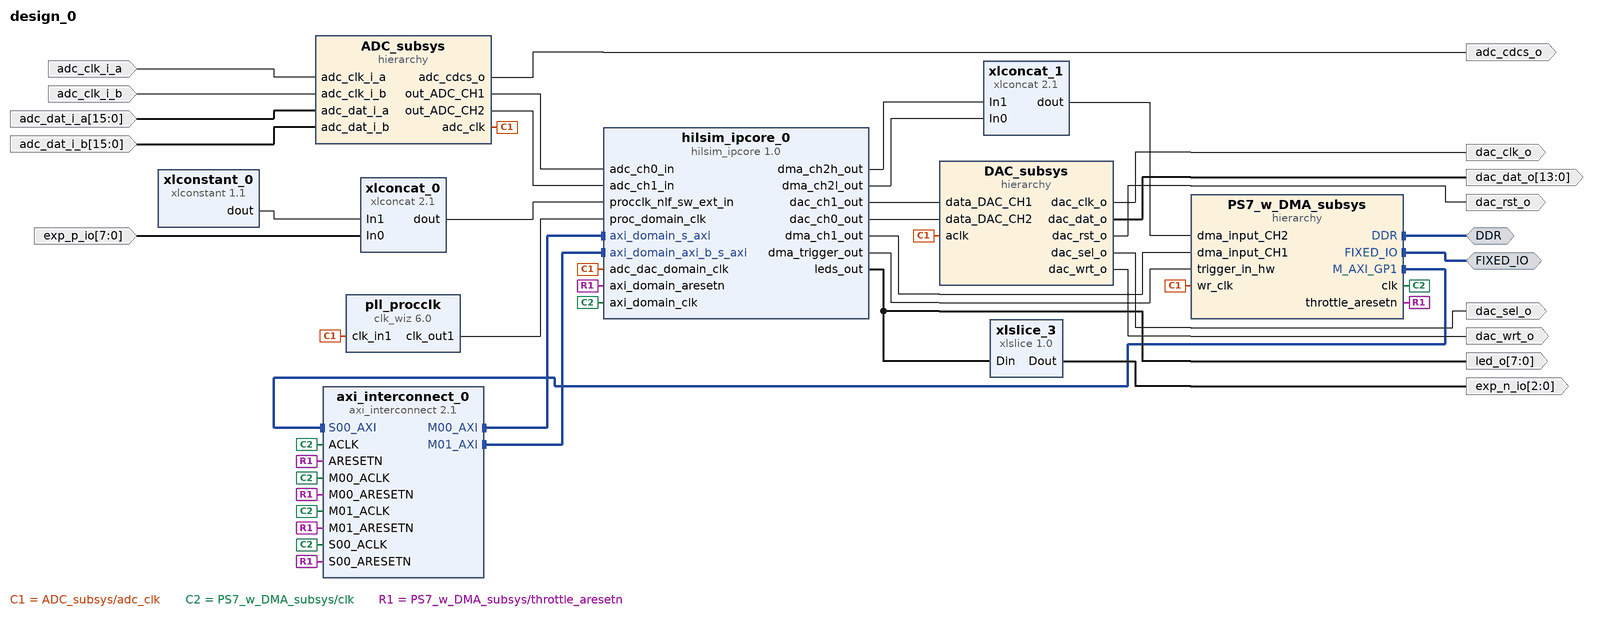
[diagram p0: block diagram of the top level]
# Vivado block design design_0, xc7z020clg400-1, Vivado 2024.2
create_bd_design design_0

create_bd_intf_port -mode Master -vlnv xilinx.com:interface:ddrx_rtl:1.0 DDR
create_bd_intf_port -mode Master -vlnv xilinx.com:display_processing_system7:fixedio_rtl:1.0 FIXED_IO
create_bd_port -dir O adc_cdcs_o
create_bd_port -dir I -type clk adc_clk_i_a
set_property -dict {CONFIG.FREQ_HZ 125000000} [get_bd_ports adc_clk_i_a]
create_bd_port -dir I -type clk adc_clk_i_b
set_property -dict {CONFIG.FREQ_HZ 125000000} [get_bd_ports adc_clk_i_b]
create_bd_port -dir I -from 15 -to 0 adc_dat_i_a
create_bd_port -dir I -from 15 -to 0 adc_dat_i_b
create_bd_port -dir O -type clk dac_clk_o
create_bd_port -dir O -from 13 -to 0 dac_dat_o
create_bd_port -dir O dac_rst_o
create_bd_port -dir O dac_sel_o
create_bd_port -dir O dac_wrt_o
create_bd_port -dir O -from 2 -to 0 exp_n_io
create_bd_port -dir I -from 7 -to 0 exp_p_io
create_bd_port -dir O -from 7 -to 0 led_o

create_bd_cell -type hier ADC_subsys
create_bd_cell -type hier DAC_subsys
create_bd_cell -type hier PS7_w_DMA_subsys
create_bd_cell -type ip -vlnv xilinx.com:ip:xlconcat:2.1 xlconcat_1
set_property -dict {CONFIG.dout_width 32} [get_bd_cells xlconcat_1]
create_bd_cell -type ip -vlnv xilinx.com:ip:xlslice:1.0 xlslice_3
set_property -dict {CONFIG.DIN_FROM 2 CONFIG.DIN_WIDTH 8 CONFIG.DOUT_WIDTH 3} [get_bd_cells xlslice_3]
create_bd_cell -type ip -vlnv xilinx.com:ip:clk_wiz:6.0 pll_procclk
set_property -dict [list \
  CONFIG.CLKIN1_JITTER_PS 80.0 \
  CONFIG.CLKOUT1_DRIVES BUFG \
  CONFIG.CLKOUT1_JITTER 104.759 \
  CONFIG.CLKOUT1_PHASE_ERROR 96.948 \
  CONFIG.CLKOUT1_REQUESTED_OUT_FREQ 250 \
  CONFIG.CLKOUT2_DRIVES BUFG \
  CONFIG.CLKOUT3_DRIVES BUFG \
  CONFIG.CLKOUT4_DRIVES BUFG \
  CONFIG.CLKOUT5_DRIVES BUFG \
  CONFIG.CLKOUT6_DRIVES BUFG \
  CONFIG.CLKOUT7_DRIVES BUFG \
  CONFIG.FEEDBACK_SOURCE FDBK_AUTO \
  CONFIG.MMCM_BANDWIDTH OPTIMIZED \
  CONFIG.MMCM_CLKFBOUT_MULT_F 8.000 \
  CONFIG.MMCM_CLKIN1_PERIOD 8.000 \
  CONFIG.MMCM_CLKIN2_PERIOD 10.000 \
  CONFIG.MMCM_CLKOUT0_DIVIDE_F 4.000 \
  CONFIG.MMCM_COMPENSATION ZHOLD \
  CONFIG.MMCM_DIVCLK_DIVIDE 1 \
  CONFIG.OVERRIDE_MMCM false \
  CONFIG.PLL_CLKIN_PERIOD 8.000 \
  CONFIG.PRIMITIVE MMCM \
  CONFIG.PRIM_IN_FREQ 125 \
  CONFIG.PRIM_SOURCE Global_buffer \
  CONFIG.USE_LOCKED false \
  CONFIG.USE_RESET false \
] [get_bd_cells pll_procclk]
create_bd_cell -type ip -vlnv User_Company:VMC:hilsim_ipcore:1.0 hilsim_ipcore_0
create_bd_cell -type ip -vlnv xilinx.com:ip:axi_interconnect:2.1 axi_interconnect_0
set_property -dict [list \
  CONFIG.M00_HAS_REGSLICE 1 \
  CONFIG.M01_HAS_REGSLICE 1 \
  CONFIG.NUM_MI 2 \
  CONFIG.NUM_SI 1 \
  CONFIG.S00_HAS_DATA_FIFO 2 \
  CONFIG.S00_HAS_REGSLICE 1 \
  CONFIG.STRATEGY 1 \
] [get_bd_cells axi_interconnect_0]
create_bd_cell -type ip -vlnv xilinx.com:ip:xlconstant:1.1 xlconstant_0
set_property -dict {CONFIG.CONST_VAL 0 CONFIG.CONST_WIDTH 1} [get_bd_cells xlconstant_0]
create_bd_cell -type ip -vlnv xilinx.com:ip:xlconcat:2.1 xlconcat_0
set_property -dict {CONFIG.IN0_WIDTH 8 CONFIG.IN1_WIDTH 1 CONFIG.dout_width 9} [get_bd_cells xlconcat_0]

# ---- hierarchy /ADC_subsys ----
current_bd_instance /ADC_subsys
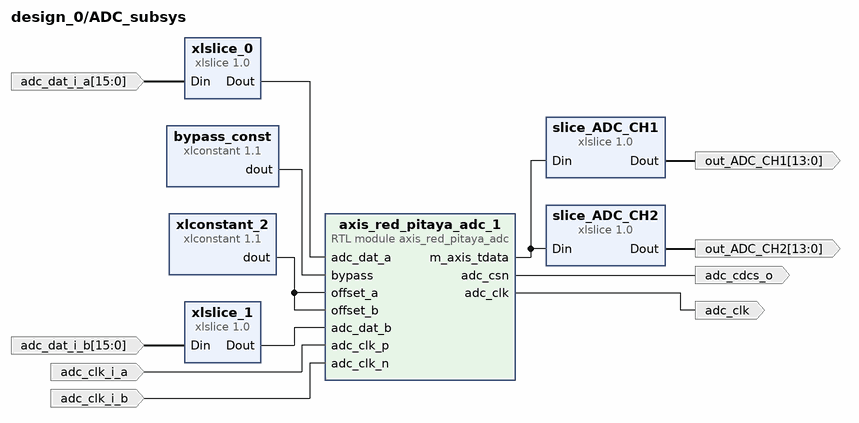
[diagram p1: block diagram inside /ADC_subsys]
create_bd_pin -dir I -from 15 -to 0 adc_dat_i_a
create_bd_pin -dir I -from 15 -to 0 adc_dat_i_b
create_bd_pin -dir O -type clk adc_clk
create_bd_pin -dir O adc_cdcs_o
create_bd_pin -dir I -type clk adc_clk_i_a
create_bd_pin -dir I -type clk adc_clk_i_b
create_bd_pin -dir O -from 13 -to 0 out_ADC_CH1
create_bd_pin -dir O -from 13 -to 0 out_ADC_CH2

create_bd_cell -type ip -vlnv xilinx.com:ip:xlslice:1.0 xlslice_0
set_property -dict {CONFIG.DIN_FROM 15 CONFIG.DIN_TO 2 CONFIG.DIN_WIDTH 16 CONFIG.DOUT_WIDTH 14} [get_bd_cells xlslice_0]
create_bd_cell -type ip -vlnv xilinx.com:ip:xlslice:1.0 xlslice_1
set_property -dict {CONFIG.DIN_FROM 15 CONFIG.DIN_TO 2 CONFIG.DIN_WIDTH 16 CONFIG.DOUT_WIDTH 14} [get_bd_cells xlslice_1]
create_bd_cell -type ip -vlnv xilinx.com:ip:xlconstant:1.1 xlconstant_2
set_property -dict {CONFIG.CONST_VAL 0 CONFIG.CONST_WIDTH 14} [get_bd_cells xlconstant_2]
create_bd_cell -type ip -vlnv xilinx.com:ip:xlconstant:1.1 bypass_const
set_property -dict {CONFIG.CONST_VAL 0} [get_bd_cells bypass_const]
create_bd_cell -type ip -vlnv xilinx.com:ip:xlslice:1.0 slice_ADC_CH1
set_property -dict {CONFIG.DIN_FROM 13 CONFIG.DIN_TO 0 CONFIG.DIN_WIDTH 32 CONFIG.DOUT_WIDTH 14} [get_bd_cells slice_ADC_CH1]
create_bd_cell -type ip -vlnv xilinx.com:ip:xlslice:1.0 slice_ADC_CH2
set_property -dict {CONFIG.DIN_FROM 29 CONFIG.DIN_TO 16 CONFIG.DIN_WIDTH 32 CONFIG.DOUT_WIDTH 14} [get_bd_cells slice_ADC_CH2]
create_bd_cell -type module -reference axis_red_pitaya_adc axis_red_pitaya_adc_1

# ---- hierarchy /DAC_subsys ----
current_bd_instance /DAC_subsys
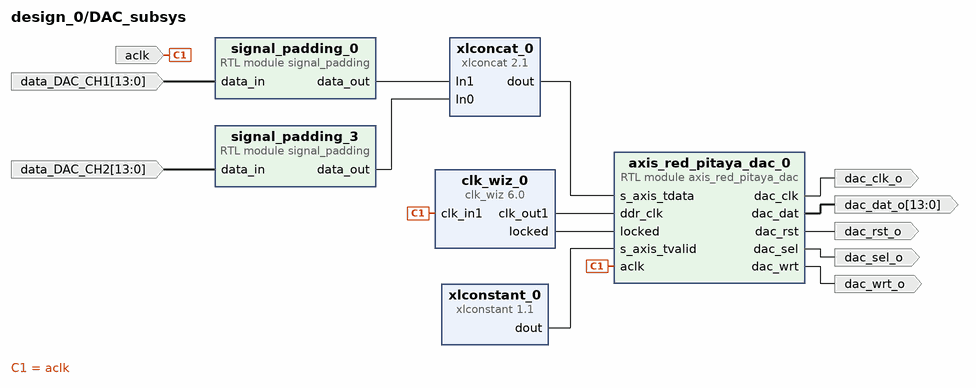
[diagram p2: block diagram inside /DAC_subsys]
create_bd_pin -dir I -from 13 -to 0 data_DAC_CH1
create_bd_pin -dir I -from 13 -to 0 data_DAC_CH2
create_bd_pin -dir I -type clk aclk
create_bd_pin -dir O -type clk dac_clk_o
create_bd_pin -dir O -type rst dac_rst_o
create_bd_pin -dir O dac_sel_o
create_bd_pin -dir O dac_wrt_o
create_bd_pin -dir O -from 13 -to 0 dac_dat_o

create_bd_cell -type ip -vlnv xilinx.com:ip:xlconcat:2.1 xlconcat_0
set_property -dict {CONFIG.dout_width 32} [get_bd_cells xlconcat_0]
create_bd_cell -type ip -vlnv xilinx.com:ip:xlconstant:1.1 xlconstant_0
create_bd_cell -type module -reference signal_padding signal_padding_0
set_property -dict {CONFIG.DATA_WIDTH_IN 14 CONFIG.DATA_WIDTH_OUT 16} [get_bd_cells signal_padding_0]
create_bd_cell -type module -reference signal_padding signal_padding_3
set_property -dict {CONFIG.DATA_WIDTH_IN 14 CONFIG.DATA_WIDTH_OUT 16} [get_bd_cells signal_padding_3]
create_bd_cell -type ip -vlnv xilinx.com:ip:clk_wiz:6.0 clk_wiz_0
set_property -dict [list \
  CONFIG.CLKIN1_JITTER_PS 80.0 \
  CONFIG.CLKOUT1_JITTER 104.759 \
  CONFIG.CLKOUT1_PHASE_ERROR 96.948 \
  CONFIG.CLKOUT1_REQUESTED_OUT_FREQ 250 \
  CONFIG.MMCM_CLKFBOUT_MULT_F 8.000 \
  CONFIG.MMCM_CLKIN1_PERIOD 8.000 \
  CONFIG.MMCM_CLKOUT0_DIVIDE_F 4.000 \
  CONFIG.PRIM_SOURCE Global_buffer \
  CONFIG.USE_RESET false \
] [get_bd_cells clk_wiz_0]
create_bd_cell -type module -reference axis_red_pitaya_dac axis_red_pitaya_dac_0

# ---- hierarchy /PS7_w_DMA_subsys ----
current_bd_instance /PS7_w_DMA_subsys
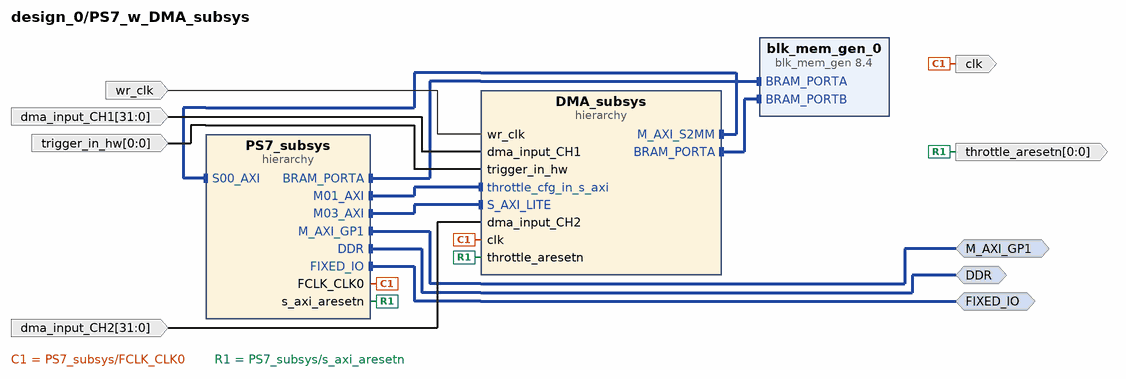
[diagram p3: block diagram inside /PS7_w_DMA_subsys]
create_bd_intf_pin -mode Master -vlnv xilinx.com:interface:ddrx_rtl:1.0 DDR
create_bd_intf_pin -mode Master -vlnv xilinx.com:display_processing_system7:fixedio_rtl:1.0 FIXED_IO
create_bd_intf_pin -mode Master -vlnv xilinx.com:interface:aximm_rtl:1.0 M_AXI_GP1
create_bd_pin -dir O -type clk clk
create_bd_pin -dir O -from 0 -to 0 -type rst throttle_aresetn
create_bd_pin -dir I -type clk wr_clk
create_bd_pin -dir I -from 31 -to 0 dma_input_CH1
create_bd_pin -dir I -from 31 -to 0 dma_input_CH2
create_bd_pin -dir I -from 0 -to 0 -type data trigger_in_hw

create_bd_cell -type ip -vlnv xilinx.com:ip:blk_mem_gen:8.4 blk_mem_gen_0
set_property -dict [list \
  CONFIG.Assume_Synchronous_Clk false \
  CONFIG.EN_SAFETY_CKT false \
  CONFIG.Enable_32bit_Address true \
  CONFIG.Enable_B Use_ENB_Pin \
  CONFIG.Memory_Type True_Dual_Port_RAM \
  CONFIG.Port_B_Clock 100 \
  CONFIG.Port_B_Enable_Rate 100 \
  CONFIG.Port_B_Write_Rate 50 \
  CONFIG.Register_PortA_Output_of_Memory_Primitives false \
  CONFIG.Register_PortB_Output_of_Memory_Primitives false \
  CONFIG.Use_RSTA_Pin true \
  CONFIG.Use_RSTB_Pin true \
  CONFIG.use_bram_block BRAM_Controller \
] [get_bd_cells blk_mem_gen_0]
create_bd_cell -type hier PS7_subsys
create_bd_cell -type hier DMA_subsys

# ---- hierarchy /PS7_w_DMA_subsys/PS7_subsys ----
current_bd_instance /PS7_w_DMA_subsys/PS7_subsys
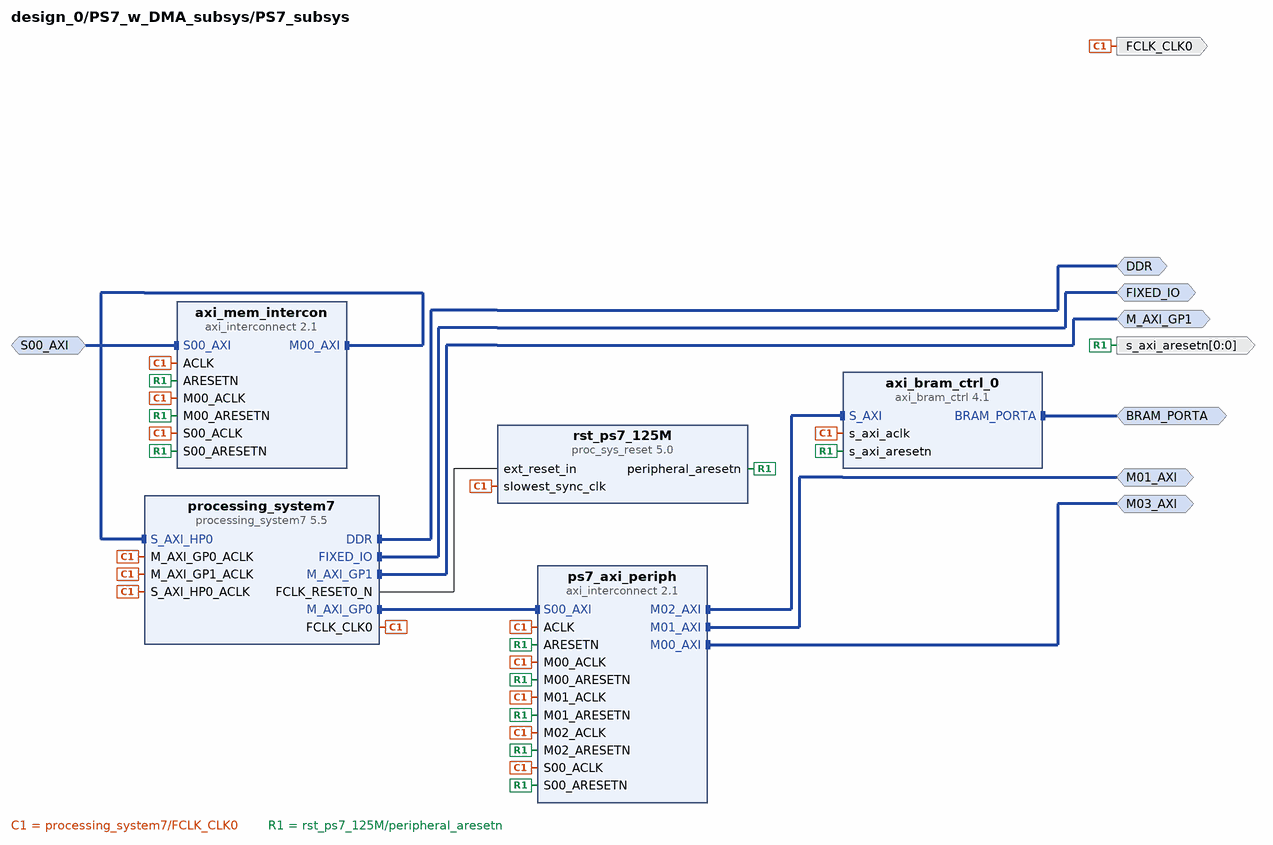
[diagram p4: block diagram inside /PS7_w_DMA_subsys/PS7_subsys]
create_bd_intf_pin -mode Master -vlnv xilinx.com:interface:ddrx_rtl:1.0 DDR
create_bd_intf_pin -mode Master -vlnv xilinx.com:display_processing_system7:fixedio_rtl:1.0 FIXED_IO
create_bd_intf_pin -mode Master -vlnv xilinx.com:interface:bram_rtl:1.0 BRAM_PORTA
create_bd_intf_pin -mode Slave -vlnv xilinx.com:interface:aximm_rtl:1.0 S00_AXI
create_bd_intf_pin -mode Master -vlnv xilinx.com:interface:aximm_rtl:1.0 M01_AXI
create_bd_intf_pin -mode Master -vlnv xilinx.com:interface:aximm_rtl:1.0 M03_AXI
create_bd_intf_pin -mode Master -vlnv xilinx.com:interface:aximm_rtl:1.0 M_AXI_GP1
create_bd_pin -dir O -type clk FCLK_CLK0
create_bd_pin -dir O -from 0 -to 0 -type rst s_axi_aresetn

create_bd_cell -type ip -vlnv xilinx.com:ip:processing_system7:5.5 processing_system7
set_property -dict [list \
  CONFIG.PCW_APU_PERIPHERAL_FREQMHZ 666.666666 \
  CONFIG.PCW_ENET0_ENET0_IO {MIO 16 .. 27} \
  CONFIG.PCW_ENET0_GRP_MDIO_ENABLE 1 \
  CONFIG.PCW_ENET0_GRP_MDIO_IO {MIO 52 .. 53} \
  CONFIG.PCW_ENET0_PERIPHERAL_ENABLE 1 \
  CONFIG.PCW_EN_RST1_PORT 1 \
  CONFIG.PCW_EN_RST2_PORT 1 \
  CONFIG.PCW_EN_RST3_PORT 1 \
  CONFIG.PCW_FPGA0_PERIPHERAL_FREQMHZ 125 \
  CONFIG.PCW_FPGA1_PERIPHERAL_FREQMHZ 250 \
  CONFIG.PCW_FPGA3_PERIPHERAL_FREQMHZ 200 \
  CONFIG.PCW_FTM_CTI_IN0 DISABLED \
  CONFIG.PCW_FTM_CTI_IN1 DISABLED \
  CONFIG.PCW_FTM_CTI_IN2 DISABLED \
  CONFIG.PCW_FTM_CTI_IN3 DISABLED \
  CONFIG.PCW_FTM_CTI_OUT0 DISABLED \
  CONFIG.PCW_FTM_CTI_OUT1 DISABLED \
  CONFIG.PCW_FTM_CTI_OUT2 DISABLED \
  CONFIG.PCW_FTM_CTI_OUT3 DISABLED \
  CONFIG.PCW_GPIO_MIO_GPIO_ENABLE 0 \
  CONFIG.PCW_I2C0_GRP_INT_ENABLE 0 \
  CONFIG.PCW_I2C0_I2C0_IO {MIO 50 .. 51} \
  CONFIG.PCW_I2C0_PERIPHERAL_ENABLE 1 \
  CONFIG.PCW_I2C_PERIPHERAL_FREQMHZ 111.111115 \
  CONFIG.PCW_PERIPHERAL_BOARD_PRESET None \
  CONFIG.PCW_PRESET_BANK1_VOLTAGE {LVCMOS 2.5V} \
  CONFIG.PCW_QSPI_GRP_SINGLE_SS_ENABLE 1 \
  CONFIG.PCW_QSPI_GRP_SINGLE_SS_IO {MIO 1 .. 6} \
  CONFIG.PCW_QSPI_PERIPHERAL_ENABLE 1 \
  CONFIG.PCW_QSPI_PERIPHERAL_FREQMHZ 125 \
  CONFIG.PCW_QSPI_QSPI_IO {MIO 1 .. 6} \
  CONFIG.PCW_SD0_GRP_CD_ENABLE 1 \
  CONFIG.PCW_SD0_GRP_CD_IO {MIO 46} \
  CONFIG.PCW_SD0_GRP_WP_ENABLE 1 \
  CONFIG.PCW_SD0_GRP_WP_IO {MIO 47} \
  CONFIG.PCW_SD0_PERIPHERAL_ENABLE 1 \
  CONFIG.PCW_SD0_SD0_IO {MIO 40 .. 45} \
  CONFIG.PCW_SDIO_PERIPHERAL_FREQMHZ 100 \
  CONFIG.PCW_SINGLE_QSPI_DATA_MODE x4 \
  CONFIG.PCW_SPI0_PERIPHERAL_ENABLE 1 \
  CONFIG.PCW_SPI0_SPI0_IO EMIO \
  CONFIG.PCW_SPI1_PERIPHERAL_ENABLE 1 \
  CONFIG.PCW_SPI1_SPI1_IO {MIO 10 .. 15} \
  CONFIG.PCW_SPI_PERIPHERAL_FREQMHZ 200 \
  CONFIG.PCW_TTC0_PERIPHERAL_ENABLE 1 \
  CONFIG.PCW_TTC0_TTC0_IO EMIO \
  CONFIG.PCW_UART0_PERIPHERAL_ENABLE 1 \
  CONFIG.PCW_UART0_UART0_IO {MIO 14 .. 15} \
  CONFIG.PCW_UART1_PERIPHERAL_ENABLE 1 \
  CONFIG.PCW_UART1_UART1_IO {MIO 8 .. 9} \
  CONFIG.PCW_UART_PERIPHERAL_FREQMHZ 100 \
  CONFIG.PCW_UIPARAM_DDR_BUS_WIDTH {16 Bit} \
  CONFIG.PCW_UIPARAM_DDR_FREQ_MHZ 533.333333 \
  CONFIG.PCW_UIPARAM_DDR_PARTNO {MT41J256M16 RE-125} \
  CONFIG.PCW_USB0_PERIPHERAL_ENABLE 0 \
  CONFIG.PCW_USE_CROSS_TRIGGER 1 \
  CONFIG.PCW_USE_FABRIC_INTERRUPT 1 \
  CONFIG.PCW_USE_M_AXI_GP1 1 \
  CONFIG.PCW_USE_S_AXI_HP0 1 \
] [get_bd_cells processing_system7]
# 474 more settings of processing_system7 are not shown: defaults, MIO pin electricals, DDR timing, and values the tool derives
create_bd_cell -type ip -vlnv xilinx.com:ip:proc_sys_reset:5.0 rst_ps7_125M
create_bd_cell -type ip -vlnv xilinx.com:ip:axi_bram_ctrl:4.1 axi_bram_ctrl_0
set_property -dict {CONFIG.PROTOCOL AXI4 CONFIG.SINGLE_PORT_BRAM 1} [get_bd_cells axi_bram_ctrl_0]
create_bd_cell -type ip -vlnv xilinx.com:ip:axi_interconnect:2.1 axi_mem_intercon
set_property -dict {CONFIG.NUM_MI 1} [get_bd_cells axi_mem_intercon]
create_bd_cell -type ip -vlnv xilinx.com:ip:axi_interconnect:2.1 ps7_axi_periph
set_property -dict {CONFIG.NUM_MI 3 CONFIG.S00_HAS_DATA_FIFO 2 CONFIG.STRATEGY 2} [get_bd_cells ps7_axi_periph]

# ---- hierarchy /PS7_w_DMA_subsys/DMA_subsys ----
current_bd_instance /PS7_w_DMA_subsys/DMA_subsys
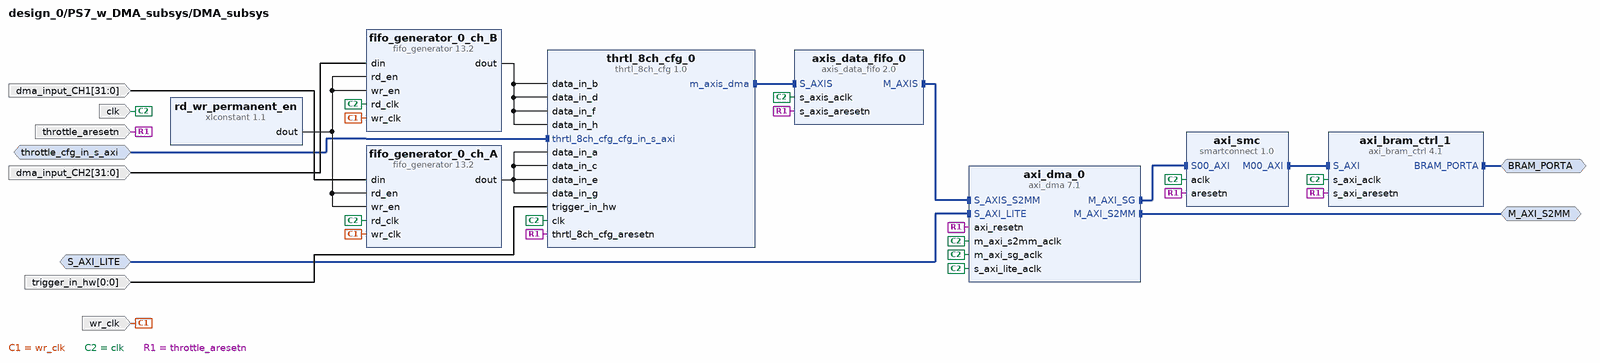
[diagram p5: block diagram inside /PS7_w_DMA_subsys/DMA_subsys]
create_bd_intf_pin -mode Slave -vlnv xilinx.com:interface:aximm_rtl:1.0 throttle_cfg_in_s_axi
create_bd_intf_pin -mode Slave -vlnv xilinx.com:interface:aximm_rtl:1.0 S_AXI_LITE
create_bd_intf_pin -mode Master -vlnv xilinx.com:interface:aximm_rtl:1.0 M_AXI_S2MM
create_bd_intf_pin -mode Master -vlnv xilinx.com:interface:bram_rtl:1.0 BRAM_PORTA
create_bd_pin -dir I -type clk wr_clk
create_bd_pin -dir I -type clk clk
create_bd_pin -dir I -from 31 -to 0 dma_input_CH1
create_bd_pin -dir I -type rst throttle_aresetn
create_bd_pin -dir I -from 31 -to 0 dma_input_CH2
create_bd_pin -dir I -from 0 -to 0 -type data trigger_in_hw

create_bd_cell -type ip -vlnv xilinx.com:ip:fifo_generator:13.2 fifo_generator_0_ch_A
set_property -dict [list \
  CONFIG.Fifo_Implementation Independent_Clocks_Distributed_RAM \
  CONFIG.Input_Data_Width 32 \
  CONFIG.Input_Depth 16 \
  CONFIG.Performance_Options First_Word_Fall_Through \
  CONFIG.Reset_Pin false \
] [get_bd_cells fifo_generator_0_ch_A]
create_bd_cell -type ip -vlnv xilinx.com:ip:smartconnect:1.0 axi_smc
set_property -dict {CONFIG.NUM_SI 1} [get_bd_cells axi_smc]
create_bd_cell -type ip -vlnv xilinx.com:ip:fifo_generator:13.2 fifo_generator_0_ch_B
set_property -dict [list \
  CONFIG.Fifo_Implementation Independent_Clocks_Distributed_RAM \
  CONFIG.Input_Data_Width 32 \
  CONFIG.Input_Depth 16 \
  CONFIG.Performance_Options First_Word_Fall_Through \
  CONFIG.Reset_Pin false \
] [get_bd_cells fifo_generator_0_ch_B]
create_bd_cell -type ip -vlnv xilinx.com:ip:axi_dma:7.1 axi_dma_0
set_property -dict [list \
  CONFIG.c_include_mm2s 0 \
  CONFIG.c_include_s2mm_dre 1 \
  CONFIG.c_s2mm_burst_size 256 \
  CONFIG.c_sg_include_stscntrl_strm 0 \
  CONFIG.c_sg_length_width 26 \
] [get_bd_cells axi_dma_0]
create_bd_cell -type ip -vlnv xilinx.com:ip:xlconstant:1.1 rd_wr_permanent_en
set_property -dict {CONFIG.CONST_VAL 1} [get_bd_cells rd_wr_permanent_en]
create_bd_cell -type ip -vlnv xilinx.com:ip:axi_bram_ctrl:4.1 axi_bram_ctrl_1
set_property -dict {CONFIG.PROTOCOL AXI4 CONFIG.RD_CMD_OPTIMIZATION 1 CONFIG.SINGLE_PORT_BRAM 1} [get_bd_cells axi_bram_ctrl_1]
create_bd_cell -type ip -vlnv VM:SysGen:thrtl_8ch_cfg:1.0 thrtl_8ch_cfg_0
create_bd_cell -type ip -vlnv xilinx.com:ip:axis_data_fifo:2.0 axis_data_fifo_0

# ---- connections ----

current_bd_instance /ADC_subsys
connect_bd_net [get_bd_pins adc_clk_i_a] [get_bd_pins axis_red_pitaya_adc_1/adc_clk_p]
connect_bd_net [get_bd_pins adc_clk_i_b] [get_bd_pins axis_red_pitaya_adc_1/adc_clk_n]
connect_bd_net [get_bd_pins adc_dat_i_a] [get_bd_pins xlslice_0/Din]
connect_bd_net [get_bd_pins adc_dat_i_b] [get_bd_pins xlslice_1/Din]
connect_bd_net [get_bd_pins axis_red_pitaya_adc_1/adc_clk] [get_bd_pins adc_clk]
connect_bd_net [get_bd_pins axis_red_pitaya_adc_1/adc_csn] [get_bd_pins adc_cdcs_o]
connect_bd_net [get_bd_pins axis_red_pitaya_adc_1/m_axis_tdata] [get_bd_pins slice_ADC_CH1/Din] [get_bd_pins slice_ADC_CH2/Din]
connect_bd_net [get_bd_pins bypass_const/dout] [get_bd_pins axis_red_pitaya_adc_1/bypass]
connect_bd_net [get_bd_pins xlconstant_2/dout] [get_bd_pins axis_red_pitaya_adc_1/offset_a] [get_bd_pins axis_red_pitaya_adc_1/offset_b]
connect_bd_net [get_bd_pins xlslice_0/Dout] [get_bd_pins axis_red_pitaya_adc_1/adc_dat_a]
connect_bd_net [get_bd_pins xlslice_1/Dout] [get_bd_pins axis_red_pitaya_adc_1/adc_dat_b]
connect_bd_net -net xlslice_2_Dout [get_bd_pins slice_ADC_CH2/Dout] [get_bd_pins out_ADC_CH2]
connect_bd_net -net xlslice_4_Dout [get_bd_pins slice_ADC_CH1/Dout] [get_bd_pins out_ADC_CH1]

current_bd_instance /DAC_subsys
connect_bd_net [get_bd_pins aclk] [get_bd_pins axis_red_pitaya_dac_0/aclk] [get_bd_pins clk_wiz_0/clk_in1]
connect_bd_net [get_bd_pins axis_red_pitaya_dac_0/dac_clk] [get_bd_pins dac_clk_o]
connect_bd_net [get_bd_pins axis_red_pitaya_dac_0/dac_dat] [get_bd_pins dac_dat_o]
connect_bd_net [get_bd_pins axis_red_pitaya_dac_0/dac_rst] [get_bd_pins dac_rst_o]
connect_bd_net [get_bd_pins axis_red_pitaya_dac_0/dac_sel] [get_bd_pins dac_sel_o]
connect_bd_net [get_bd_pins axis_red_pitaya_dac_0/dac_wrt] [get_bd_pins dac_wrt_o]
connect_bd_net [get_bd_pins clk_wiz_0/clk_out1] [get_bd_pins axis_red_pitaya_dac_0/ddr_clk]
connect_bd_net [get_bd_pins clk_wiz_0/locked] [get_bd_pins axis_red_pitaya_dac_0/locked]
connect_bd_net -net fpga_kf1_0_dac_pulse_out [get_bd_pins data_DAC_CH2] [get_bd_pins signal_padding_3/data_in]
connect_bd_net -net fpga_kf1_0_gate_fb_out [get_bd_pins data_DAC_CH1] [get_bd_pins signal_padding_0/data_in]
connect_bd_net [get_bd_pins signal_padding_0/data_out] [get_bd_pins xlconcat_0/In1]
connect_bd_net [get_bd_pins signal_padding_3/data_out] [get_bd_pins xlconcat_0/In0]
connect_bd_net [get_bd_pins xlconcat_0/dout] [get_bd_pins axis_red_pitaya_dac_0/s_axis_tdata]
connect_bd_net [get_bd_pins xlconstant_0/dout] [get_bd_pins axis_red_pitaya_dac_0/s_axis_tvalid]

current_bd_instance /PS7_w_DMA_subsys
connect_bd_intf_net [get_bd_intf_pins M_AXI_GP1] [get_bd_intf_pins PS7_subsys/M_AXI_GP1]
connect_bd_intf_net -intf_net axi_bram_ctrl_0_BRAM_PORTA [get_bd_intf_pins PS7_subsys/BRAM_PORTA] [get_bd_intf_pins blk_mem_gen_0/BRAM_PORTA]
connect_bd_intf_net -intf_net axi_bram_ctrl_1_BRAM_PORTA [get_bd_intf_pins DMA_subsys/BRAM_PORTA] [get_bd_intf_pins blk_mem_gen_0/BRAM_PORTB]
connect_bd_intf_net -intf_net axi_dma_0_M_AXI_S2MM [get_bd_intf_pins DMA_subsys/M_AXI_S2MM] [get_bd_intf_pins PS7_subsys/S00_AXI]
connect_bd_intf_net -intf_net processing_system7_DDR [get_bd_intf_pins DDR] [get_bd_intf_pins PS7_subsys/DDR]
connect_bd_intf_net -intf_net processing_system7_FIXED_IO [get_bd_intf_pins FIXED_IO] [get_bd_intf_pins PS7_subsys/FIXED_IO]
connect_bd_intf_net [get_bd_intf_pins PS7_subsys/M01_AXI] [get_bd_intf_pins DMA_subsys/throttle_cfg_in_s_axi]
connect_bd_intf_net [get_bd_intf_pins PS7_subsys/M03_AXI] [get_bd_intf_pins DMA_subsys/S_AXI_LITE]
connect_bd_net [get_bd_pins wr_clk] [get_bd_pins DMA_subsys/wr_clk]
connect_bd_net -net fpga_kf1_0_dma_out [get_bd_pins dma_input_CH1] [get_bd_pins DMA_subsys/dma_input_CH1]
connect_bd_net -net fpga_kf1_0_dma_trigger_output [get_bd_pins trigger_in_hw] [get_bd_pins DMA_subsys/trigger_in_hw]
connect_bd_net -net processing_system7_FCLK_CLK0 [get_bd_pins PS7_subsys/FCLK_CLK0] [get_bd_pins clk] [get_bd_pins DMA_subsys/clk]
connect_bd_net -net rst_ps7_125M_peripheral_aresetn [get_bd_pins PS7_subsys/s_axi_aresetn] \
  [get_bd_pins throttle_aresetn] [get_bd_pins DMA_subsys/throttle_aresetn]
connect_bd_net -net xlconcat_1_dout [get_bd_pins dma_input_CH2] [get_bd_pins DMA_subsys/dma_input_CH2]

current_bd_instance /PS7_w_DMA_subsys/PS7_subsys
connect_bd_intf_net [get_bd_intf_pins ps7_axi_periph/S00_AXI] [get_bd_intf_pins processing_system7/M_AXI_GP0]
connect_bd_intf_net [get_bd_intf_pins BRAM_PORTA] [get_bd_intf_pins axi_bram_ctrl_0/BRAM_PORTA]
connect_bd_intf_net -intf_net axi_dma_0_M_AXI_S2MM [get_bd_intf_pins S00_AXI] [get_bd_intf_pins axi_mem_intercon/S00_AXI]
connect_bd_intf_net [get_bd_intf_pins axi_mem_intercon/M00_AXI] [get_bd_intf_pins processing_system7/S_AXI_HP0]
connect_bd_intf_net [get_bd_intf_pins DDR] [get_bd_intf_pins processing_system7/DDR]
connect_bd_intf_net [get_bd_intf_pins FIXED_IO] [get_bd_intf_pins processing_system7/FIXED_IO]
connect_bd_intf_net [get_bd_intf_pins M_AXI_GP1] [get_bd_intf_pins processing_system7/M_AXI_GP1]
connect_bd_intf_net [get_bd_intf_pins M03_AXI] [get_bd_intf_pins ps7_axi_periph/M00_AXI]
connect_bd_intf_net [get_bd_intf_pins M01_AXI] [get_bd_intf_pins ps7_axi_periph/M01_AXI]
connect_bd_intf_net [get_bd_intf_pins ps7_axi_periph/M02_AXI] [get_bd_intf_pins axi_bram_ctrl_0/S_AXI]
connect_bd_net [get_bd_pins processing_system7/FCLK_CLK0] \
  [get_bd_pins FCLK_CLK0] [get_bd_pins processing_system7/S_AXI_HP0_ACLK] [get_bd_pins processing_system7/M_AXI_GP0_ACLK] \
  [get_bd_pins processing_system7/M_AXI_GP1_ACLK] [get_bd_pins axi_bram_ctrl_0/s_axi_aclk] \
  [get_bd_pins axi_mem_intercon/ACLK] [get_bd_pins axi_mem_intercon/S00_ACLK] [get_bd_pins axi_mem_intercon/M00_ACLK] \
  [get_bd_pins ps7_axi_periph/ACLK] [get_bd_pins ps7_axi_periph/S00_ACLK] [get_bd_pins ps7_axi_periph/M00_ACLK] \
  [get_bd_pins ps7_axi_periph/M01_ACLK] [get_bd_pins ps7_axi_periph/M02_ACLK] [get_bd_pins rst_ps7_125M/slowest_sync_clk]
connect_bd_net [get_bd_pins processing_system7/FCLK_RESET0_N] [get_bd_pins rst_ps7_125M/ext_reset_in]
connect_bd_net [get_bd_pins rst_ps7_125M/peripheral_aresetn] \
  [get_bd_pins s_axi_aresetn] [get_bd_pins axi_bram_ctrl_0/s_axi_aresetn] [get_bd_pins axi_mem_intercon/ARESETN] \
  [get_bd_pins axi_mem_intercon/S00_ARESETN] [get_bd_pins axi_mem_intercon/M00_ARESETN] [get_bd_pins ps7_axi_periph/ARESETN] \
  [get_bd_pins ps7_axi_periph/S00_ARESETN] [get_bd_pins ps7_axi_periph/M00_ARESETN] [get_bd_pins ps7_axi_periph/M01_ARESETN] \
  [get_bd_pins ps7_axi_periph/M02_ARESETN]
set_property HDL_ATTRIBUTE.BMM_INFO_PROCESSOR {arm > design_0 PS7_w_DMA_subsys/PS7_subsys/axi_bram_ctrl_0} [get_bd_cells processing_system7]
set_property HDL_ATTRIBUTE.KEEP_HIERARCHY yes [get_bd_cells processing_system7]
set_property HDL_ATTRIBUTE.BMM_INFO_ADDRESS_SPACE {byte  0x40000000 32 > design_0 PS7_w_DMA_subsys/blk_mem_gen_0} [get_bd_cells axi_bram_ctrl_0]
set_property HDL_ATTRIBUTE.KEEP_HIERARCHY yes [get_bd_cells axi_bram_ctrl_0]

current_bd_instance /PS7_w_DMA_subsys/DMA_subsys
connect_bd_intf_net [get_bd_intf_pins BRAM_PORTA] [get_bd_intf_pins axi_bram_ctrl_1/BRAM_PORTA]
connect_bd_intf_net [get_bd_intf_pins M_AXI_S2MM] [get_bd_intf_pins axi_dma_0/M_AXI_S2MM]
connect_bd_intf_net [get_bd_intf_pins axi_dma_0/M_AXI_SG] [get_bd_intf_pins axi_smc/S00_AXI]
connect_bd_intf_net [get_bd_intf_pins axi_smc/M00_AXI] [get_bd_intf_pins axi_bram_ctrl_1/S_AXI]
connect_bd_intf_net [get_bd_intf_pins axis_data_fifo_0/M_AXIS] [get_bd_intf_pins axi_dma_0/S_AXIS_S2MM]
connect_bd_intf_net [get_bd_intf_pins S_AXI_LITE] [get_bd_intf_pins axi_dma_0/S_AXI_LITE]
connect_bd_intf_net [get_bd_intf_pins throttle_cfg_in_s_axi] [get_bd_intf_pins thrtl_8ch_cfg_0/thrtl_8ch_cfg_cfg_in_s_axi]
connect_bd_intf_net [get_bd_intf_pins axis_data_fifo_0/S_AXIS] [get_bd_intf_pins thrtl_8ch_cfg_0/m_axis_dma]
connect_bd_net [get_bd_pins wr_clk] [get_bd_pins fifo_generator_0_ch_A/wr_clk] [get_bd_pins fifo_generator_0_ch_B/wr_clk]
connect_bd_net [get_bd_pins fifo_generator_0_ch_B/dout] \
  [get_bd_pins thrtl_8ch_cfg_0/data_in_b] [get_bd_pins thrtl_8ch_cfg_0/data_in_d] [get_bd_pins thrtl_8ch_cfg_0/data_in_f] \
  [get_bd_pins thrtl_8ch_cfg_0/data_in_h]
connect_bd_net -net fifo_generator_0_dout [get_bd_pins fifo_generator_0_ch_A/dout] \
  [get_bd_pins thrtl_8ch_cfg_0/data_in_a] [get_bd_pins thrtl_8ch_cfg_0/data_in_c] [get_bd_pins thrtl_8ch_cfg_0/data_in_e] \
  [get_bd_pins thrtl_8ch_cfg_0/data_in_g]
connect_bd_net -net fpga_kf1_0_dma_out [get_bd_pins dma_input_CH1] [get_bd_pins fifo_generator_0_ch_A/din]
connect_bd_net -net fpga_kf1_0_dma_trigger_output [get_bd_pins trigger_in_hw] [get_bd_pins thrtl_8ch_cfg_0/trigger_in_hw]
connect_bd_net -net processing_system7_FCLK_CLK0 [get_bd_pins clk] \
  [get_bd_pins thrtl_8ch_cfg_0/clk] [get_bd_pins axi_bram_ctrl_1/s_axi_aclk] [get_bd_pins axi_dma_0/s_axi_lite_aclk] \
  [get_bd_pins axi_dma_0/m_axi_sg_aclk] [get_bd_pins axi_dma_0/m_axi_s2mm_aclk] [get_bd_pins axi_smc/aclk] \
  [get_bd_pins axis_data_fifo_0/s_axis_aclk] [get_bd_pins fifo_generator_0_ch_A/rd_clk] \
  [get_bd_pins fifo_generator_0_ch_B/rd_clk]
connect_bd_net -net rst_ps7_125M_peripheral_aresetn [get_bd_pins throttle_aresetn] \
  [get_bd_pins thrtl_8ch_cfg_0/thrtl_8ch_cfg_aresetn] [get_bd_pins axi_bram_ctrl_1/s_axi_aresetn] \
  [get_bd_pins axi_dma_0/axi_resetn] [get_bd_pins axi_smc/aresetn] [get_bd_pins axis_data_fifo_0/s_axis_aresetn]
connect_bd_net -net xlconcat_1_dout [get_bd_pins dma_input_CH2] [get_bd_pins fifo_generator_0_ch_B/din]
connect_bd_net -net xlconstant_3_dout [get_bd_pins rd_wr_permanent_en/dout] \
  [get_bd_pins fifo_generator_0_ch_A/wr_en] [get_bd_pins fifo_generator_0_ch_A/rd_en] \
  [get_bd_pins fifo_generator_0_ch_B/wr_en] [get_bd_pins fifo_generator_0_ch_B/rd_en]

current_bd_instance /
connect_bd_intf_net [get_bd_intf_pins PS7_w_DMA_subsys/M_AXI_GP1] [get_bd_intf_pins axi_interconnect_0/S00_AXI]
connect_bd_intf_net [get_bd_intf_pins axi_interconnect_0/M00_AXI] [get_bd_intf_pins hilsim_ipcore_0/axi_domain_s_axi]
connect_bd_intf_net [get_bd_intf_pins hilsim_ipcore_0/axi_domain_axi_b_s_axi] [get_bd_intf_pins axi_interconnect_0/M01_AXI]
connect_bd_intf_net -intf_net processing_system7_DDR [get_bd_intf_ports DDR] [get_bd_intf_pins PS7_w_DMA_subsys/DDR]
connect_bd_intf_net -intf_net processing_system7_FIXED_IO [get_bd_intf_ports FIXED_IO] [get_bd_intf_pins PS7_w_DMA_subsys/FIXED_IO]
connect_bd_net [get_bd_pins ADC_subsys/adc_clk] \
  [get_bd_pins DAC_subsys/aclk] [get_bd_pins PS7_w_DMA_subsys/wr_clk] [get_bd_pins pll_procclk/clk_in1] \
  [get_bd_pins hilsim_ipcore_0/adc_dac_domain_clk]
connect_bd_net [get_bd_pins ADC_subsys/out_ADC_CH1] [get_bd_pins hilsim_ipcore_0/adc_ch0_in]
connect_bd_net [get_bd_pins ADC_subsys/out_ADC_CH2] [get_bd_pins hilsim_ipcore_0/adc_ch1_in]
connect_bd_net [get_bd_pins PS7_w_DMA_subsys/clk] \
  [get_bd_pins axi_interconnect_0/ACLK] [get_bd_pins axi_interconnect_0/S00_ACLK] [get_bd_pins axi_interconnect_0/M00_ACLK] \
  [get_bd_pins axi_interconnect_0/M01_ACLK] [get_bd_pins hilsim_ipcore_0/axi_domain_clk]
connect_bd_net [get_bd_pins PS7_w_DMA_subsys/throttle_aresetn] \
  [get_bd_pins axi_interconnect_0/ARESETN] [get_bd_pins axi_interconnect_0/S00_ARESETN] \
  [get_bd_pins axi_interconnect_0/M00_ARESETN] [get_bd_pins axi_interconnect_0/M01_ARESETN] \
  [get_bd_pins hilsim_ipcore_0/axi_domain_aresetn]
connect_bd_net [get_bd_ports adc_clk_i_a] [get_bd_pins ADC_subsys/adc_clk_i_a]
connect_bd_net [get_bd_ports adc_clk_i_b] [get_bd_pins ADC_subsys/adc_clk_i_b]
connect_bd_net [get_bd_ports adc_dat_i_a] [get_bd_pins ADC_subsys/adc_dat_i_a]
connect_bd_net [get_bd_ports adc_dat_i_b] [get_bd_pins ADC_subsys/adc_dat_i_b]
connect_bd_net -net axis_red_pitaya_adc_0_adc_csn [get_bd_pins ADC_subsys/adc_cdcs_o] [get_bd_ports adc_cdcs_o]
connect_bd_net -net axis_red_pitaya_dac_0_dac_clk [get_bd_pins DAC_subsys/dac_clk_o] [get_bd_ports dac_clk_o]
connect_bd_net -net axis_red_pitaya_dac_0_dac_dat [get_bd_pins DAC_subsys/dac_dat_o] [get_bd_ports dac_dat_o]
connect_bd_net -net axis_red_pitaya_dac_0_dac_rst [get_bd_pins DAC_subsys/dac_rst_o] [get_bd_ports dac_rst_o]
connect_bd_net -net axis_red_pitaya_dac_0_dac_sel [get_bd_pins DAC_subsys/dac_sel_o] [get_bd_ports dac_sel_o]
connect_bd_net -net axis_red_pitaya_dac_0_dac_wrt [get_bd_pins DAC_subsys/dac_wrt_o] [get_bd_ports dac_wrt_o]
connect_bd_net -net data_DAC_CH1_1 [get_bd_pins hilsim_ipcore_0/dac_ch1_out] [get_bd_pins DAC_subsys/data_DAC_CH1]
connect_bd_net -net dma_input_CH1_1 [get_bd_pins hilsim_ipcore_0/dma_ch1_out] [get_bd_pins PS7_w_DMA_subsys/dma_input_CH1]
connect_bd_net [get_bd_ports exp_p_io] [get_bd_pins xlconcat_0/In0]
connect_bd_net [get_bd_pins hilsim_ipcore_0/dac_ch0_out] [get_bd_pins DAC_subsys/data_DAC_CH2]
connect_bd_net [get_bd_pins hilsim_ipcore_0/dma_ch2h_out] [get_bd_pins xlconcat_1/In1]
connect_bd_net [get_bd_pins hilsim_ipcore_0/dma_ch2l_out] [get_bd_pins xlconcat_1/In0]
connect_bd_net [get_bd_pins hilsim_ipcore_0/leds_out] [get_bd_ports led_o] [get_bd_pins xlslice_3/Din]
connect_bd_net [get_bd_pins pll_procclk/clk_out1] [get_bd_pins hilsim_ipcore_0/proc_domain_clk]
connect_bd_net -net trigger_in_hw_1 [get_bd_pins hilsim_ipcore_0/dma_trigger_out] [get_bd_pins PS7_w_DMA_subsys/trigger_in_hw]
connect_bd_net [get_bd_pins xlconcat_0/dout] [get_bd_pins hilsim_ipcore_0/procclk_nlf_sw_ext_in]
connect_bd_net [get_bd_pins xlconcat_1/dout] [get_bd_pins PS7_w_DMA_subsys/dma_input_CH2]
connect_bd_net [get_bd_pins xlconstant_0/dout] [get_bd_pins xlconcat_0/In1]
connect_bd_net [get_bd_pins xlslice_3/Dout] [get_bd_ports exp_n_io]

# ---- address map ----
assign_bd_address -offset 0x10000000 -range 256M -target_address_space [get_bd_addr_spaces PS7_w_DMA_subsys/DMA_subsys/axi_dma_0/Data_S2MM] [get_bd_addr_segs PS7_w_DMA_subsys/PS7_subsys/processing_system7/S_AXI_HP0/HP0_DDR_LOWOCM]
assign_bd_address -offset 0x40000000 -range 8K -target_address_space [get_bd_addr_spaces PS7_w_DMA_subsys/DMA_subsys/axi_dma_0/Data_SG] [get_bd_addr_segs PS7_w_DMA_subsys/DMA_subsys/axi_bram_ctrl_1/S_AXI/Mem0]
assign_bd_address -offset 0x40000000 -range 8K -target_address_space [get_bd_addr_spaces PS7_w_DMA_subsys/PS7_subsys/processing_system7/Data] [get_bd_addr_segs PS7_w_DMA_subsys/PS7_subsys/axi_bram_ctrl_0/S_AXI/Mem0]
assign_bd_address -offset 0x40400000 -range 64K -target_address_space [get_bd_addr_spaces PS7_w_DMA_subsys/PS7_subsys/processing_system7/Data] [get_bd_addr_segs PS7_w_DMA_subsys/DMA_subsys/axi_dma_0/S_AXI_LITE/Reg]
assign_bd_address -offset 0x43C10000 -range 64K -target_address_space [get_bd_addr_spaces PS7_w_DMA_subsys/PS7_subsys/processing_system7/Data] [get_bd_addr_segs PS7_w_DMA_subsys/DMA_subsys/thrtl_8ch_cfg_0/thrtl_8ch_cfg_cfg_in_s_axi/reg0]
assign_bd_address -offset 0x80000000 -range 512 -target_address_space [get_bd_addr_spaces PS7_w_DMA_subsys/PS7_subsys/processing_system7/Data] [get_bd_addr_segs hilsim_ipcore_0/axi_domain_s_axi/reg0]
assign_bd_address -offset 0x80000200 -range 512 -target_address_space [get_bd_addr_spaces PS7_w_DMA_subsys/PS7_subsys/processing_system7/Data] [get_bd_addr_segs hilsim_ipcore_0/axi_domain_axi_b_s_axi/reg0]

validate_bd_design
save_bd_design
